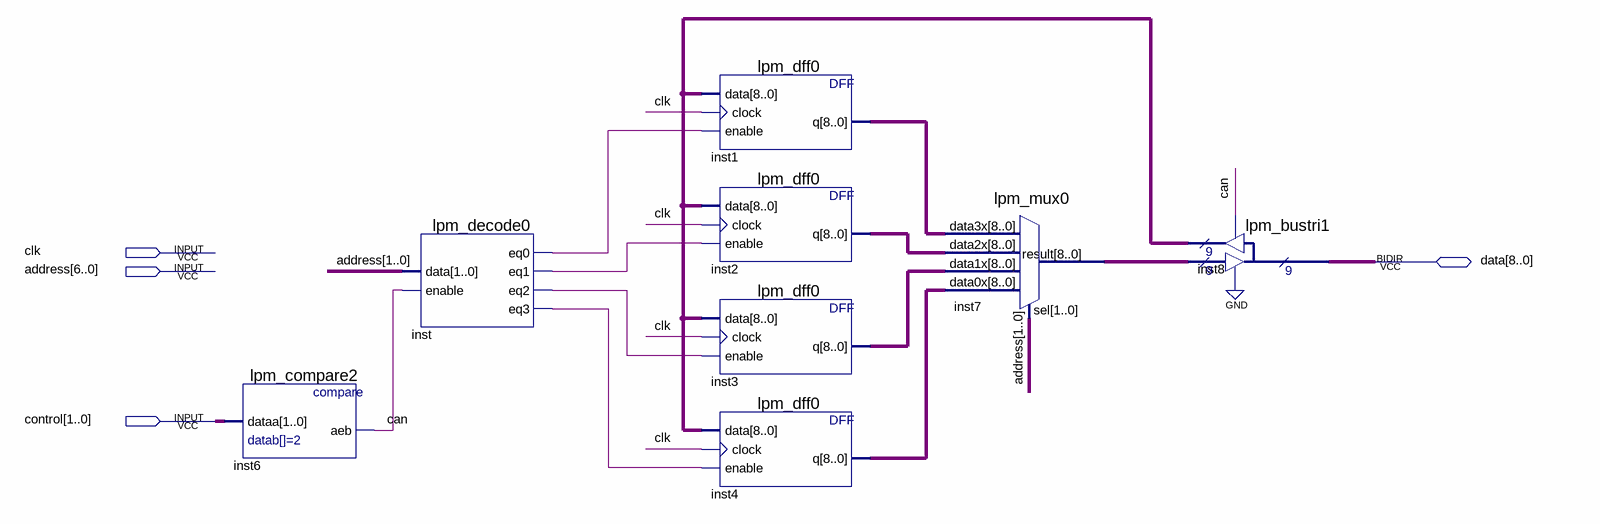
[diagram p0: schematic sheet]
// Quartus schematic POH.bdf as structural Verilog: 8 symbols, 4 pins
module POH (
  input  clk,
  input  [6:0] address,
  input  [1:0] control,
  inout  [8:0] data
);

  wire can, inst_eq0, inst_eq1, inst_eq2, inst_eq3;
  wire [8:0] inst1_q, inst2_q, inst3_q, inst4_q, inst7_result, inst8_result;

  lpm_compare2 inst6 (.dataa(control), .aeb(can));
  lpm_decode0 inst (.data(address[1:0]), .enable(can), .eq0(inst_eq0), .eq1(inst_eq1), .eq2(inst_eq2), .eq3(inst_eq3));
  lpm_dff0 inst1 (.data(inst8_result), .clock(clk), .enable(inst_eq0), .q(inst1_q));
  lpm_dff0 inst2 (.data(inst8_result), .clock(clk), .enable(inst_eq1), .q(inst2_q));
  lpm_dff0 inst3 (.data(inst8_result), .clock(clk), .enable(inst_eq2), .q(inst3_q));
  lpm_dff0 inst4 (.data(inst8_result), .clock(clk), .enable(inst_eq3), .q(inst4_q));
  lpm_mux0 inst7 (
    .data3x(inst1_q), .data2x(inst2_q), .data1x(inst3_q), .data0x(inst4_q), .sel(address[1:0]),
    .result(inst7_result));
  lpm_bustri1 inst8 (.enabledt(1'b0), .data(inst7_result), .enabletr(can), .result(inst8_result), .tridata(data));
endmodule
